# Altium schematic sheet usb3.SchDoc
size 420 x 297 mm
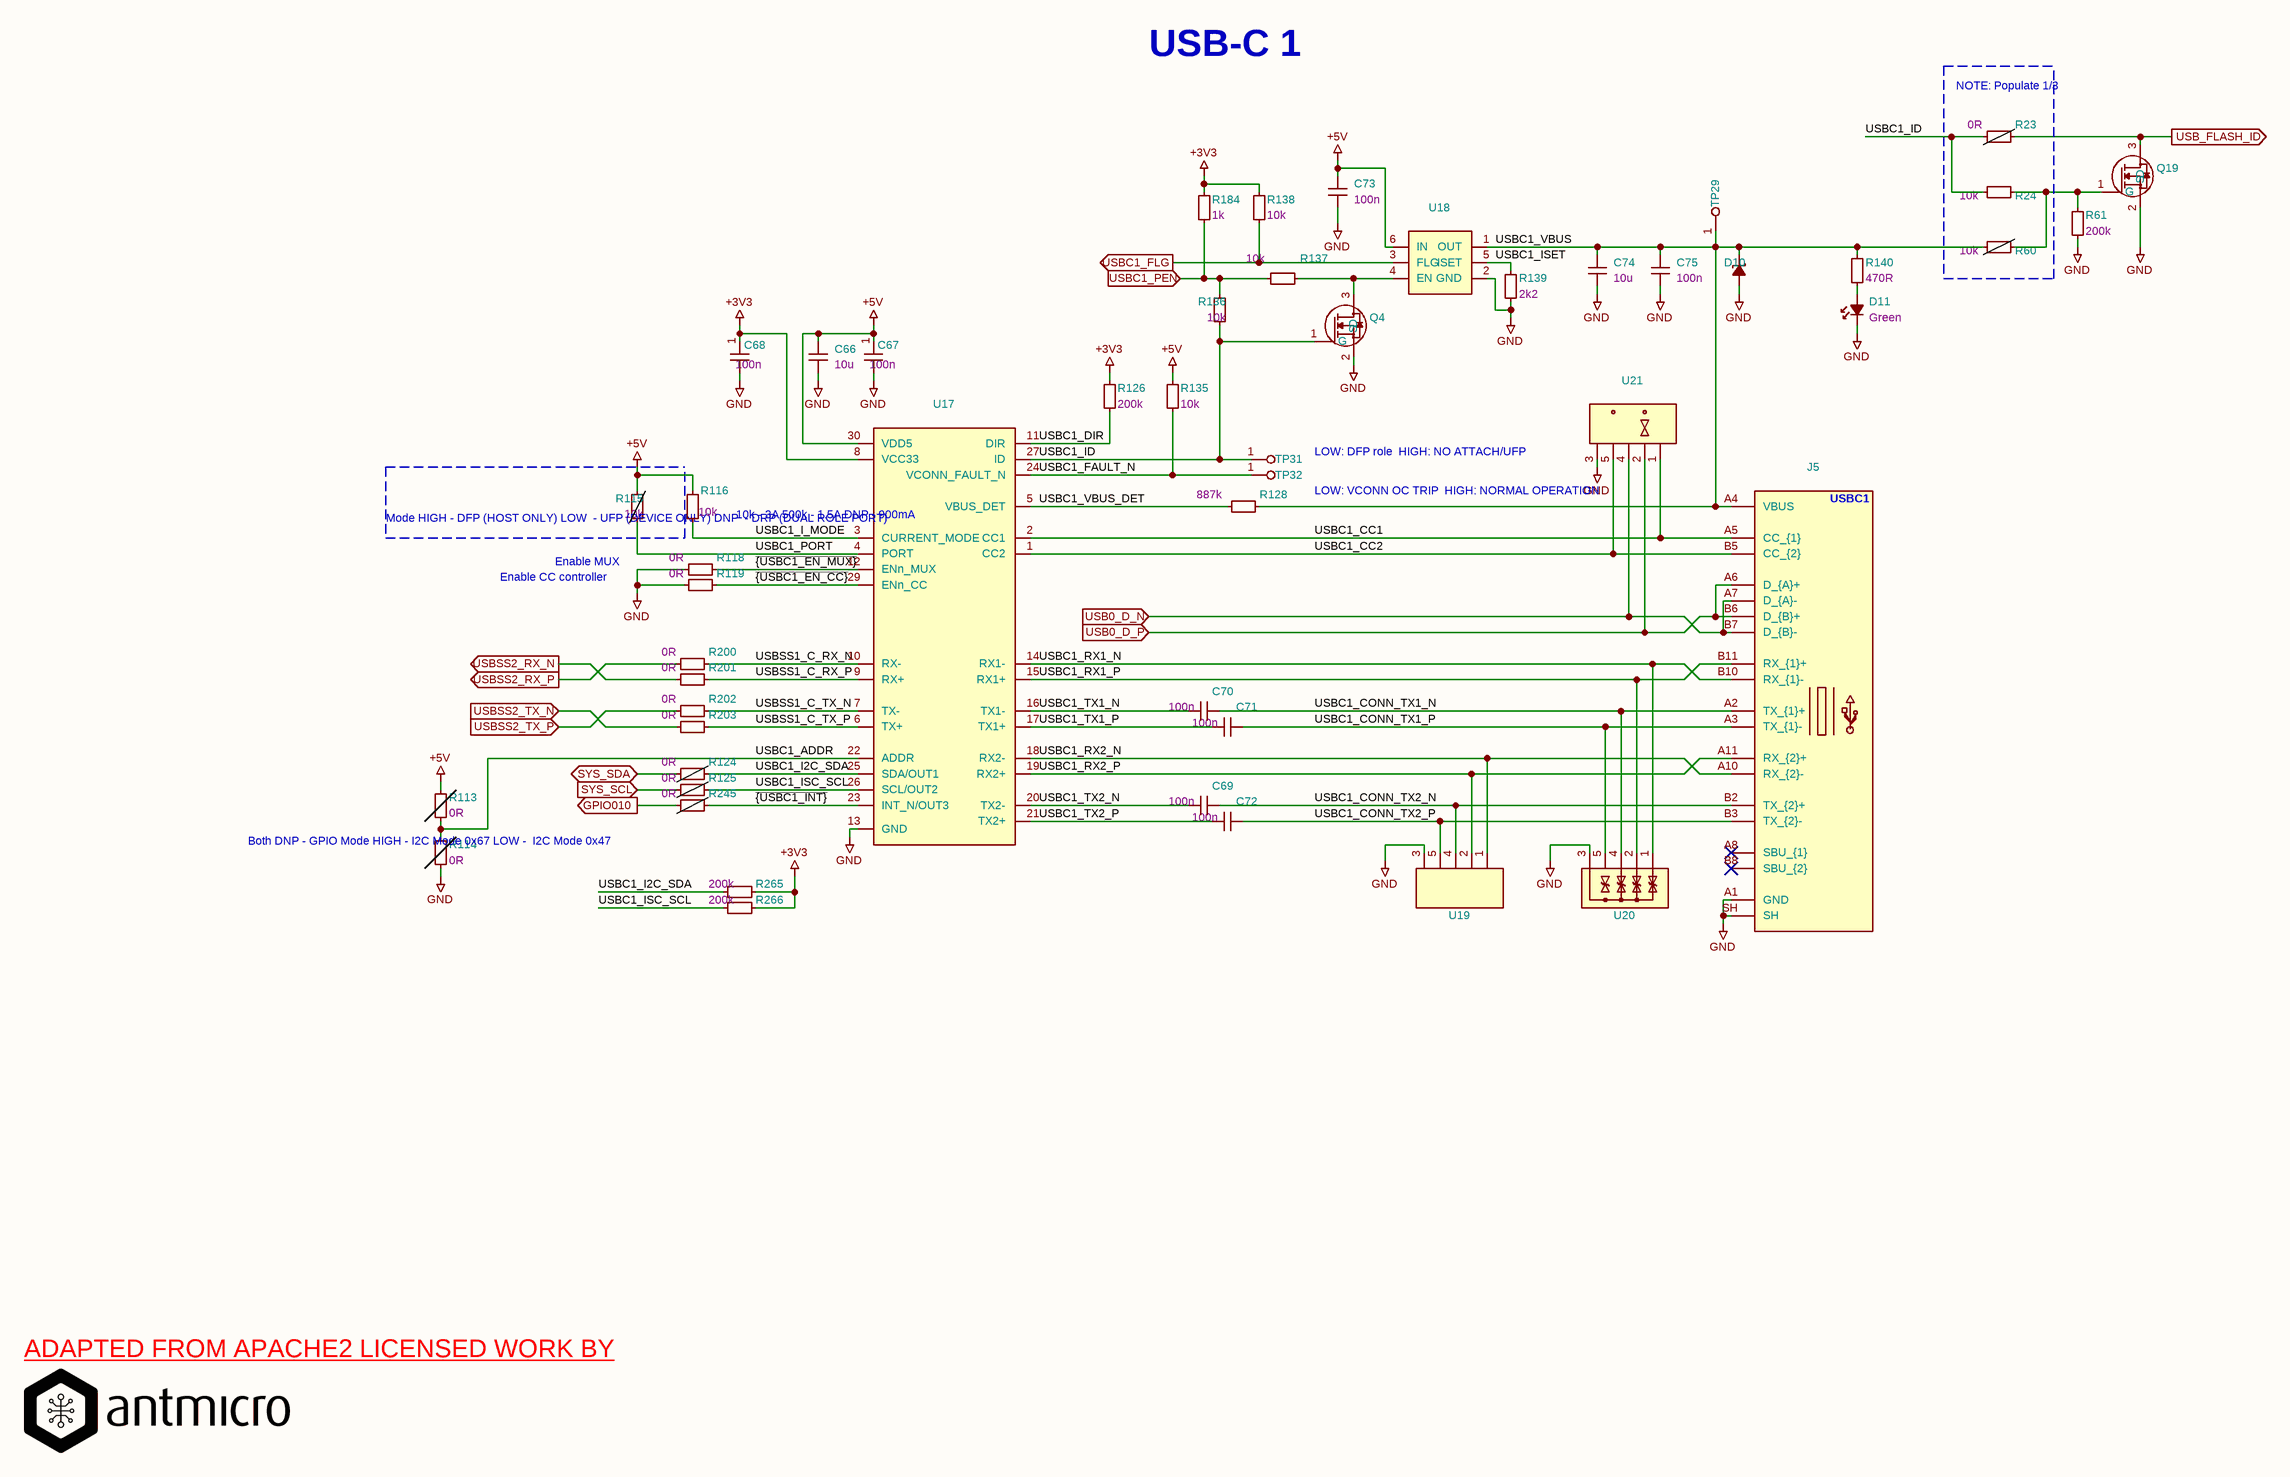
[diagram p0: usb3.SchDoc]

## Parts
C66  Val: 10u  [C_0603_1608Metric]  (hidden comment: GRM188R61A106KE69D)
C67  Val: 100n  [C_0402_1005Metric]  (hidden comment: GRM155R61H104KE14D)
C68  Val: 100n  [C_0402_1005Metric]  (hidden comment: GRM155R61H104KE14D)
C69  Val: 100n  [C_0402_1005Metric]  (hidden comment: GRM155R61H104KE14D)
C70  Val: 100n  [C_0402_1005Metric]  (hidden comment: GRM155R61H104KE14D)
C71  Val: 100n  [C_0402_1005Metric]  (hidden comment: GRM155R61H104KE14D)
C72  Val: 100n  [C_0402_1005Metric]  (hidden comment: GRM155R61H104KE14D)
C73  Val: 100n  [C_0402_1005Metric]  (hidden comment: GRM155R61H104KE14D)
C74  Val: 10u  [C_0603_1608Metric]  (hidden comment: GRM188R61A106KE69D)
C75  Val: 100n  [C_0402_1005Metric]  (hidden comment: GRM155R61H104KE14D)
D10  ESD9X5.0ST5G  [SOD-923]  (value not drawn)
D11  Color: Green  [LED_0603_1608Metric_G]  (hidden comment: LTST-C190GKT)
J5  632723300011  [USB-C_Receptacle_WE_632723300011]  (value not drawn)
Q4  PJE138K_R1_00001  [SOT-523]  (value not drawn)
Q19  PJE138K_R1_00001  [SOT-523]  (value not drawn)
R23  Val: 0R  [R_0402_1005Metric]  (hidden comment: ERJ2GE0R00X)  (no BOM)
R24  Val: 10k  [R_0402_1005Metric]  (hidden comment: CR0402-FX-1002GLF)
R60  Val: 10k  [R_0402_1005Metric]  (hidden comment: CR0402-FX-1002GLF)  (no BOM)
R61  Val: 200k  [R_0402_1005Metric]  (hidden comment: CR0402-FX-2003GLF)
R113  Val: 0R  [R_0402_1005Metric]  (hidden comment: ERJ2GE0R00X)  (no BOM)
R114  Val: 0R  [R_0402_1005Metric]  (hidden comment: ERJ2GE0R00X)  (no BOM)
R115  Val: 10k  [R_0402_1005Metric]  (hidden comment: CR0402-FX-1002GLF)  (no BOM)
R116  Val: 10k  [R_0402_1005Metric]  (hidden comment: CR0402-FX-1002GLF)
R118  Val: 0R  [R_0402_1005Metric]  (hidden comment: ERJ2GE0R00X)
R119  Val: 0R  [R_0402_1005Metric]  (hidden comment: ERJ2GE0R00X)
R124  Val: 0R  [R_0402_1005Metric]  (hidden comment: ERJ2GE0R00X)  (no BOM)
R125  Val: 0R  [R_0402_1005Metric]  (hidden comment: ERJ2GE0R00X)  (no BOM)
R126  Val: 200k  [R_0402_1005Metric]  (hidden comment: CR0402-FX-2003GLF)
R128  Val: 887k  [R_0402_1005Metric]  (hidden comment: ERJ-2RKF8873X)
R135  Val: 10k  [R_0402_1005Metric]  (hidden comment: CR0402-FX-1002GLF)
R136  Val: 10k  [R_0402_1005Metric]  (hidden comment: CR0402-FX-1002GLF)
R137  Val: 10k  [R_0402_1005Metric]  (hidden comment: CR0402-FX-1002GLF)
R138  Val: 10k  [R_0402_1005Metric]  (hidden comment: CR0402-FX-1002GLF)
R139  Val: 2k2  [R_0402_1005Metric]  (hidden comment: CR0402-FX-2201GLF)
R140  Val: 470R  [R_0402_1005Metric]  (hidden comment: CR0402-FX-4700GLF)
R184  Val: 1k  [R_0402_1005Metric]  (hidden comment: CR0402-FX-1001GLF)
R200  Val: 0R  [R_0402_1005Metric]  (hidden comment: ERJ2GE0R00X)
R201  Val: 0R  [R_0402_1005Metric]  (hidden comment: ERJ2GE0R00X)
R202  Val: 0R  [R_0402_1005Metric]  (hidden comment: ERJ2GE0R00X)
R203  Val: 0R  [R_0402_1005Metric]  (hidden comment: ERJ2GE0R00X)
R245  Val: 0R  [R_0402_1005Metric]  (hidden comment: ERJ2GE0R00X)  (no BOM)
R265  Val: 200k  [R_0402_1005Metric]  (hidden comment: CR0402-FX-2003GLF)
R266  Val: 200k  [R_0402_1005Metric]  (hidden comment: CR0402-FX-2003GLF)
TP29  TP_0.75mm_SMD  [TP_SMD_0.75mm]  (value not drawn)  (no BOM)
TP31  TP_0.75mm_SMD  [TP_SMD_0.75mm]  (value not drawn)  (no BOM)
TP32  TP_0.75mm_SMD  [TP_SMD_0.75mm]  (value not drawn)  (no BOM)
U17  HD3SS3220RNHT  [WQFN-30-1EP_4.6x2.6mm_P0.4mm]  (value not drawn)
U18  AP22615AWU-7  [TSOT23-6]  (value not drawn)
U19  TPD4E05U06QDQARQ1  [USON-10_2.5x1mm_P0.5mm]  (value not drawn)
U20  TPD4E05U06QDQARQ1  [USON-10_2.5x1mm_P0.5mm]  (value not drawn)
U21  TPD4E05U06QDQARQ1  [USON-10_2.5x1mm_P0.5mm]  (value not drawn)

## Blocks framed on the sheet
NOTE: / Populate 1/3: R23 R24 R60

## Ports
GPIO010 (out), SYS_SCL (in), SYS_SDA (bidir), USB0_D_N (in), USB0_D_P (in), USB_FLASH_ID (out), USBC1_FLG (out), USBC1_PEN (in), USBSS2_RX_N (out), USBSS2_RX_P (out), USBSS2_TX_N (in), USBSS2_TX_P (in)

## Nets
+3V3: C68.1 R126.2 R138.2 R184.2 R265.1 R266.1 U17.8(VCC33)
+5V: C66.1 C67.1 C73.1 R113.2 R115.1 R116.2 R135.2 U17.30(VDD5) U18.6(IN)
GND: C66.2 C67.2 C68.2 C73.2 C74.2 C75.2 D10.2(A) D11.1(C) J5.A1(GND) J5.SH Q4.2(S) Q19.2(S) R61.1 R114.1 R118.1 R119.1 R139.1 U17.13(GND) U18.2(GND) U19.3 U20.3 U21.3
GPIO010: R245.1 ; port GPIO010
SYS_SCL: R125.1 ; port SYS_SCL
SYS_SDA: R124.1 ; port SYS_SDA
USB0_D_N: J5.A7(D_{A}-) J5.B7(D_{B}-) U21.4 ; port USB0_D_N
USB0_D_P: J5.A6(D_{A}+) J5.B6(D_{B}+) U21.2 ; port USB0_D_P
USB_FLASH_ID: Q19.3(D) R23.2 ; port USB_FLASH_ID
USBC1_ADDR: R113.1 R114.2 U17.22(ADDR)
USBC1_CC1: J5.A5(CC_{1}) U17.2(CC1) U21.1
USBC1_CC2: J5.B5(CC_{2}) U17.1(CC2) U21.5
USBC1_CONN_TX1_N: C70.1 J5.A2(TX_{1}+) U20.4
USBC1_CONN_TX1_P: C71.1 J5.A3(TX_{1}-) U20.5
USBC1_CONN_TX2_N: C69.1 J5.B2(TX_{2}+) U19.4
USBC1_CONN_TX2_P: C72.1 J5.B3(TX_{2}-) U19.5
USBC1_DIR: R126.1 U17.11(DIR)
USBC1_FAULT_N: R135.1 TP32.1 U17.24(VCONN_FAULT_N)
USBC1_FLG: R138.1 U18.3(FLG) ; port USBC1_FLG
USBC1_I2C_SDA: R124.2 R265.2 U17.25(SDA/OUT1)
USBC1_I_MODE: R116.1 U17.3(CURRENT_MODE)
USBC1_ID: Q4.1(G) R23.1 R24.2 R136.2 TP31.1 U17.27(ID)
USBC1_ISC_SCL: R125.2 R266.2 U17.26(SCL/OUT2)
USBC1_ISET: R139.2 U18.5(ISET)
USBC1_PEN: R136.1 R137.2 R184.1 ; port USBC1_PEN
USBC1_PORT: R115.2 U17.4(PORT)
USBC1_RX1_N: J5.B10(RX_{1}-) U17.14(RX1-) U20.1
USBC1_RX1_P: J5.B11(RX_{1}+) U17.15(RX1+) U20.2
USBC1_RX2_N: J5.A10(RX_{2}-) U17.18(RX2-) U19.1
USBC1_RX2_P: J5.A11(RX_{2}+) U17.19(RX2+) U19.2
USBC1_TX1_N: C70.2 U17.16(TX1-)
USBC1_TX1_P: C71.2 U17.17(TX1+)
USBC1_TX2_N: C69.2 U17.20(TX2-)
USBC1_TX2_P: C72.2 U17.21(TX2+)
USBC1_VBUS: C74.1 C75.1 D10.1(C) J5.A4(VBUS) R60.2 R128.2 R140.2 TP29.1 U18.1(OUT)
USBC1_VBUS_DET: R128.1 U17.5(VBUS_DET)
USBSS1_C_RX_N: R200.2 U17.10(RX-)
USBSS1_C_RX_P: R201.2 U17.9(RX+)
USBSS1_C_TX_N: R202.2 U17.7(TX-)
USBSS1_C_TX_P: R203.2 U17.6(TX+)
USBSS2_RX_N: R201.1 ; port USBSS2_RX_N
USBSS2_RX_P: R200.1 ; port USBSS2_RX_P
USBSS2_TX_N: R203.1 ; port USBSS2_TX_N
USBSS2_TX_P: R202.1 ; port USBSS2_TX_P
~{{USBC1_EN_CC}}: R119.2 U17.29(ENn_CC)
~{{USBC1_EN_MUX}}: R118.2 U17.12(ENn_MUX)
~{{USBC1_INT}}: R245.2 U17.23(INT_N/OUT3)
NetD11_2: D11.2(A) R140.1
NetQ4_3: Q4.3(D) R137.1 U18.4(EN)
NetQ19_1: Q19.1(G) R24.1 R60.1 R61.2

Not connected (* = marked no-connect by the designer): J5 A8(SBU_{1})* A9(VBUS) A12(GND) B1(GND) B4(VBUS) B8(SBU_{2})* B9(VBUS) B12(GND); U17 28(GND) 31(GND); U19 6 7 8 9 10; U20 6 7 8 9 10; U21 6 7 8 9 10

## Notes on the sheet
- USB-C 1
- LOW: DFP role
  HIGH: NO ATTACH/UFP
- Mode
  HIGH - DFP (HOST ONLY)
  LOW  - UFP (DEVICE ONLY)
  DNP  - DRP (DUAL ROLE PORT)
- (near U17) 10k - 3A
  500k - 1.5A
  DNP - 900mA
- LOW: VCONN OC TRIP
  HIGH: NORMAL OPERATION
- USBC1
- Enable CC controller
- (near R115) Enable MUX
- (near R114) Both DNP - GPIO Mode
  HIGH - I2C Mode 0x67
  LOW -  I2C Mode 0x47
- ADAPTED FROM APACHE2 LICENSED WORK BY <https://github.com/antmicro/jetson-orin-baseboard>
- 1
- 2
- 3
- 4
- 5
- 6
- 7
- 8
- A
- B
- C
- D
- E
- www.antmicro.com <http://www.antmicro.com>
- Title: Jetson Orin Baseboard
- File: usb3.kicad_sch
- Sheet: /
- Antmicro Ltd
- F
- KiCad E.D.A.  kicad (5.1.4)-1
- Size: A3
- Date: 2025-01-15
- Rev: 1.3.0
- Id: 1/1

## Library data of the parts
C66 C74 = C_10u_0603: Manufacturer 1: Murata; License: Apache-2.0; Dielectric: template_dielectric; Author: Antmicro; OldValue: C_10u_0603; Manufacturer Part Number 1: GRM188R61A106KE69D; Value: GRM188R61A106KE69D; Footprint: antmicro-footprints:C_0603_1608Metric
C67-C73 C75 = C_100n_0402: Manufacturer 1: Murata; License: Apache-2.0; Voltage: 50V; Dielectric: X5R; Author: Antmicro; OldValue: C_100n_0402; Manufacturer Part Number 1: GRM155R61H104KE14D; Value: GRM155R61H104KE14D; Footprint: antmicro-footprints:C_0402_1005Metric
D10 = ESD9X5.0ST5G: Manufacturer 1: ON Semiconductor; License: Apache-2.0; Author: Antmicro; OldValue: ESD9X5.0ST5G; Manufacturer Part Number 1: ESD9X5.0ST5G; Value: ESD9X5.0ST5G; Footprint: antmicro-footprints:SOD-923
D11 = LED_G_0603_LTST-C190GKT: Manufacturer 1: Lite-On; License: Apache-2.0; Author: Antmicro; OldValue: LED_G_0603_LTST-C190GKT; Manufacturer Part Number 1: LTST-C190GKT; Value: LTST-C190GKT; Footprint: antmicro-footprints:LED_0603_1608Metric_G
J5 = USB-C_WE_632723300011: Manufacturer 1: Würth Elektronik; License: Apache-2.0; Author: Antmicro; OldValue: USB-C_WE_632723300011; Manufacturer Part Number 1: 632723300011; Value: 632723300011; Footprint: antmicro-footprints:USB-C_Receptacle_WE_632723300011
Q4 Q19 = PJE138K: Manufacturer 1: PANJIT; License: Apache-2.0; Author: Antmicro; OldValue: PJE138K; Manufacturer Part Number 1: PJE138K_R1_00001; Value: PJE138K_R1_00001; Footprint: antmicro-footprints:SOT-523
R23 R118 R119 R124 R125 R200-R203 R245 = R_0R_0402: Manufacturer 1: Panasonic; License: Apache-2.0; Tolerance: ~; Current: 1A; Author: Antmicro; OldValue: R_0R_0402; Manufacturer Part Number 1: ERJ2GE0R00X; Value: ERJ2GE0R00X; Footprint: antmicro-footprints:R_0402_1005Metric
R24 R60 R116 R135-R138 = R_10k_0402: Manufacturer 1: Bourns; License: Apache-2.0; Tolerance: 1%; Author: Antmicro; OldValue: R_10k_0402; Manufacturer Part Number 1: CR0402-FX-1002GLF; Value: CR0402-FX-1002GLF; Footprint: antmicro-footprints:R_0402_1005Metric
R61 R126 R265 R266 = R_200k_0402: Manufacturer 1: Bourns; License: Apache-2.0; Tolerance: 1%; Author: Antmicro; OldValue: R_200k_0402; Manufacturer Part Number 1: CR0402-FX-2003GLF; Value: CR0402-FX-2003GLF; Footprint: antmicro-footprints:R_0402_1005Metric
R113 = R_0R_0402_6: Manufacturer 1: Panasonic; License: Apache-2.0; Tolerance: ~; Current: 1A; Author: Antmicro; OldValue: R_0R_0402; Manufacturer Part Number 1: ERJ2GE0R00X; Value: ERJ2GE0R00X; Footprint: antmicro-footprints:R_0402_1005Metric
R114 = R_0R_0402_1: Manufacturer 1: Panasonic; License: Apache-2.0; Tolerance: ~; Current: 1A; Author: Antmicro; OldValue: R_0R_0402; Manufacturer Part Number 1: ERJ2GE0R00X; Value: ERJ2GE0R00X; Footprint: antmicro-footprints:R_0402_1005Metric
R115 = R_10k_0402_2: Manufacturer 1: Bourns; License: Apache-2.0; Tolerance: 1%; Author: Antmicro; OldValue: R_10k_0402; Manufacturer Part Number 1: CR0402-FX-1002GLF; Value: CR0402-FX-1002GLF; Footprint: antmicro-footprints:R_0402_1005Metric
R128 = R_887k_0402: Manufacturer 1: Panasonic; License: Apache-2.0; Tolerance: 1%; Author: Antmicro; OldValue: R_887k_0402; Manufacturer Part Number 1: ERJ-2RKF8873X; Value: ERJ-2RKF8873X; Footprint: antmicro-footprints:R_0402_1005Metric
R139 = R_2k2_0402: Manufacturer 1: Bourns; License: Apache-2.0; Tolerance: 1%; Author: Antmicro; OldValue: R_2k2_0402; Manufacturer Part Number 1: CR0402-FX-2201GLF; Value: CR0402-FX-2201GLF; Footprint: antmicro-footprints:R_0402_1005Metric
R140 = R_470R_0402: Manufacturer 1: Bourns; License: Apache-2.0; Tolerance: 1%; Author: Antmicro; OldValue: R_470R_0402; Manufacturer Part Number 1: CR0402-FX-4700GLF; Value: CR0402-FX-4700GLF; Footprint: antmicro-footprints:R_0402_1005Metric
R184 = R_1k_0402: Manufacturer 1: Bourns; License: Apache-2.0; Tolerance: 1%; Author: Antmicro; OldValue: R_1k_0402; Manufacturer Part Number 1: CR0402-FX-1001GLF; Value: CR0402-FX-1001GLF; Footprint: antmicro-footprints:R_0402_1005Metric
TP29 TP31 TP32 = TP_0.75mm_SMD: License: Apache-2.0; Author: Antmicro; OldValue: TP_0.75mm_SMD; Value: TP_0.75mm_SMD; Footprint: antmicro-footprints:TP_SMD_0.75mm
U17 = HD3SS3220RNH: Manufacturer 1: Texas Instruments; License: Apache-2.0; Author: Antmicro; OldValue: HD3SS3220RNH; Manufacturer Part Number 1: HD3SS3220RNHT; Value: HD3SS3220RNHT; Footprint: antmicro-footprints:WQFN-30-1EP_4.6x2.6mm_P0.4mm
U18 = AP22615A_TSOT26: Manufacturer 1: Diodes Incorporated; License: Apache-2.0; Author: Antmicro; OldValue: AP22615A_TSOT26; Manufacturer Part Number 1: AP22615AWU-7; Value: AP22615AWU-7; Footprint: antmicro-footprints:TSOT23-6
U19-U21 = TPD4E05U06QDQARQ1: Manufacturer 1: Texas Instruments; License: Apache-2.0; Author: Antmicro; OldValue: TPD4E05U06QDQARQ1; Manufacturer Part Number 1: TPD4E05U06QDQARQ1; Value: TPD4E05U06QDQARQ1; Footprint: antmicro-footprints:USON-10_2.5x1mm_P0.5mm